# EAGLE design irdroid-htpc (EAGLE 6.5.0)
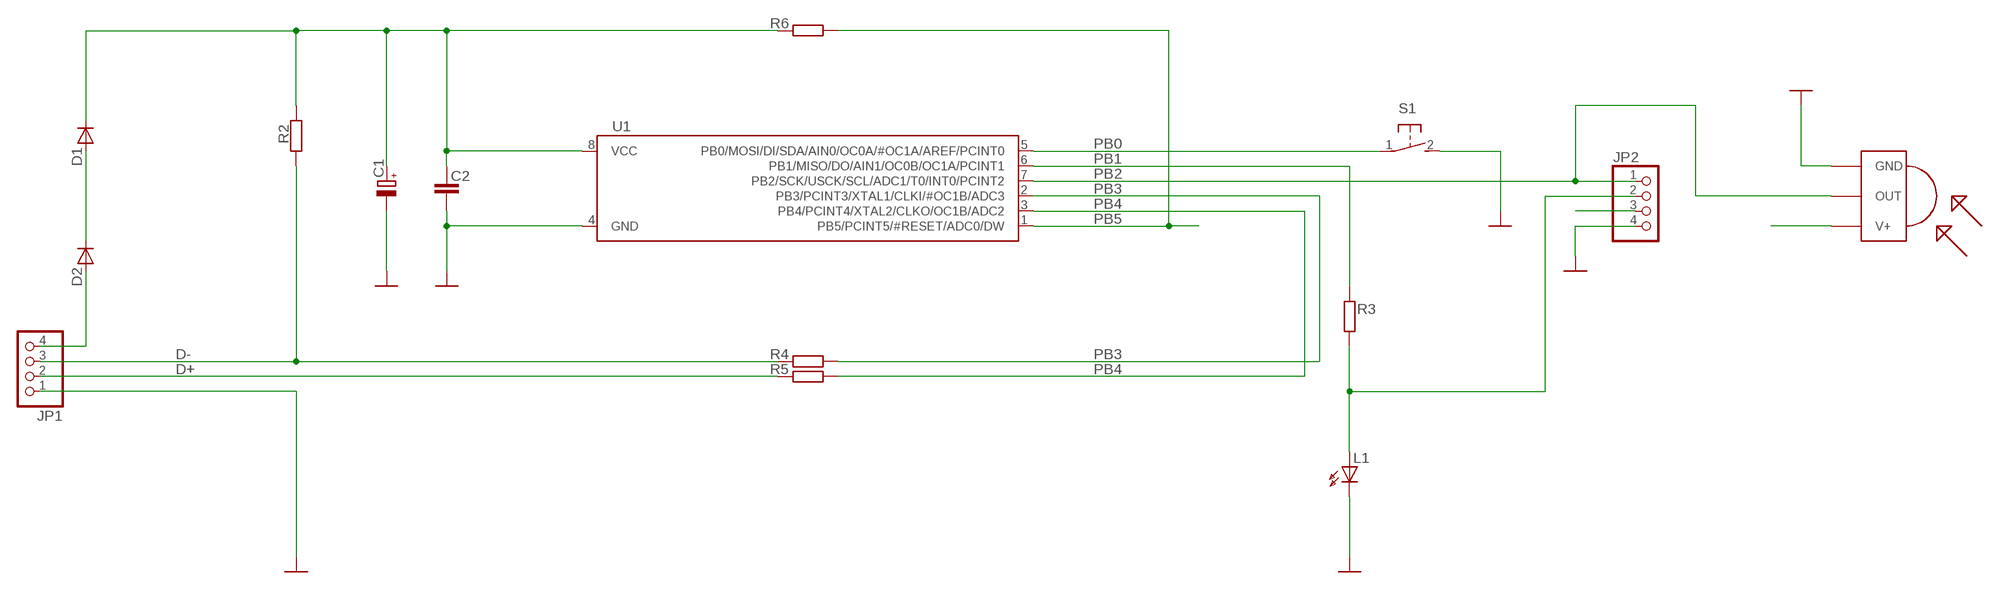
[diagram p0: schematic, sheet 1]

## Parts
C1  CPOL-EUE2-5  [E2-5]
C2  C-EU025-025X050  [C025-025X050]
D1  DDO35  [DO35-200MILS]
D2  DDO35  [DO35-200MILS]
JP1  PINHD-1X4  [1X04]
JP2  PINHD-1X4  [1X04]
L1  LED3.0MM  [LED-3.0MM]
R2  R-EU_0204/5  [0204/5]
R3  R-EU_0204/5  [0204/5]
R4  R-EU_0204/5  [0204/5]
R5  R-EU_0204/5  [0204/5]
R6  R-EU_0204/5  [0204/5]
S1  31-XX  [B3F-31XX]
U1  ATTINY85-20PU  [DIP8]
U$1  TSOP1838  [TSOP18XX]

## Nets
D+: JP1.2 R5.1
D-: JP1.3 R2.1 R4.1
GND [PWR]: C1.- C2.2 JP1.1 JP2.4 L1.K(C) S1.2(S) U1.4(GND) U$1.GND
N$2 [PWR]: D1.A D2.K
N$4: JP2.2 L1.A R3.1
PB0: S1.1(P) U1.5(PB0/MOSI/DI/SDA/AIN0/OC0A/#OC1A/AREF/PCINT0)
PB1: R3.2 U1.6(PB1/MISO/DO/AIN1/OC0B/OC1A/PCINT1)
PB2: JP2.1 U1.7(PB2/SCK/USCK/SCL/ADC1/T0/INT0/PCINT2) U$1.OUT
PB3: R4.2 U1.2(PB3/PCINT3/XTAL1/CLKI/#OC1B/ADC3)
PB4: R5.2 U1.3(PB4/PCINT4/XTAL2/CLKO/OC1B/ADC2)
PB5: R6.2 U1.1(PB5/PCINT5/#RESET/ADC0/DW)
VBUS [PWR]: D2.A JP1.4
VCC [PWR]: C1.+ C2.1 D1.K JP2.3 R2.2 R6.1 U1.8(VCC) U$1.VCC(V+)

## Library data of the parts
C1 = rcl:CPOL-EU: POLARIZED CAPACITOR, European symbol
C2 = rcl:C-EU: CAPACITOR, European symbol
D1 D2 = DOUBLE-SIDE:D: DIODES
JP1 JP2 = pinhead:PINHD-1X4: PIN HEADER
L1 = DOUBLE-SIDE:LED
R2-R6 = rcl:R-EU_: RESISTOR, European symbol
S1 = switch-omron:31-XX: OMRON SWITCH; MPN: B3F-3100; OC_FARNELL: 959704; OC_NEWARK: 36M3582
U1 = OLIMEX_IC:ATTINY85: Atmel 8-bit AVR Microcontroller with 2/4/8K Bytes In-System Programmable Flash Features *High Performance, Low Power AVR® 8-Bit Microcontroller * Advanced RISC Architecture - 120 Powerful Instructions ? Most Single Clock Cycle Execution - 32 x 8 General Purpose Working Registers - Fully Static Operation * Non-volatile Program and Data Memories - 2/4/8K Bytes of In-System Programmable Program Memory Flash * Endurance: 10,000 Write/Erase Cycles - 128/256/512 Bytes In-System Programmable EEPROM * Endurance: 100,000 Write/Erase Cycles - 128/256/512 Bytes Internal SRAM -Programming Lock for Self-Programming Flash Program and EEPROM Data Security *Peripheral Features - 8-bit Timer/Counter with Prescaler and Two PWM Channels - 8-bit High Speed Timer/Counter with Separate Prescaler *2 High Frequency PWM Outputs with Separate Output Compare Registers * Programmable Dead Time Generator -USI - Universal Serial Interface with Start Condition Detector - 10-bit ADC * 4 Single Ended Channels * 2 Differential ADC Channel Pairs with Programmable Gain (1x, 20x) * Temperature Measurement - Programmable Watchdog Timer with Separate On-chip Oscillator - On-chip Analog Comparator * Special Microcontroller Features - debugWIRE On-chip Debug System - In-System Programmable via SPI Port -External and Internal Interrupt Sources - Low Power Idle, ADC Noise Reduction, and Power-down Modes - Enhanced Power-on Reset Circuit - Programmable Brown-out Detection Circuit - Internal Calibrated Oscillator * I/O and Packages - Six Programmable I/O Lines - 8-pin PDIP, 8-pin SOIC, 20-pad QFN/MLF, and 8-pin TSSOP (only ATtiny45/V) * Operating Voltage - 1.8 - 5.5V for ATtiny25V/45V/85V - 2.7 - 5.5V for ATtiny25/45/85 * Speed Grade - ATtiny25V/45V/85V: 0 - 4 MHz @ 1.8 - 5.5V, 0 - 10 MHz @ 2.7 - 5.5V - ATtiny25/45/85: 0 - 10 MHz @ 2.7 - 5.5V, 0 - 20 MHz @ 4.5 - 5.5V * Industrial Temperature Range * Low Power Consumption - Active Mode: * 1 MHz, 1.8V: 300 uA - Power-down Mode: * 0.1 uA at 1.8V
U$1 = tsop:TSOP1838: IR Receiver and Demodulator

## Net classes
1 PWR: width 0.25 mm

## Board
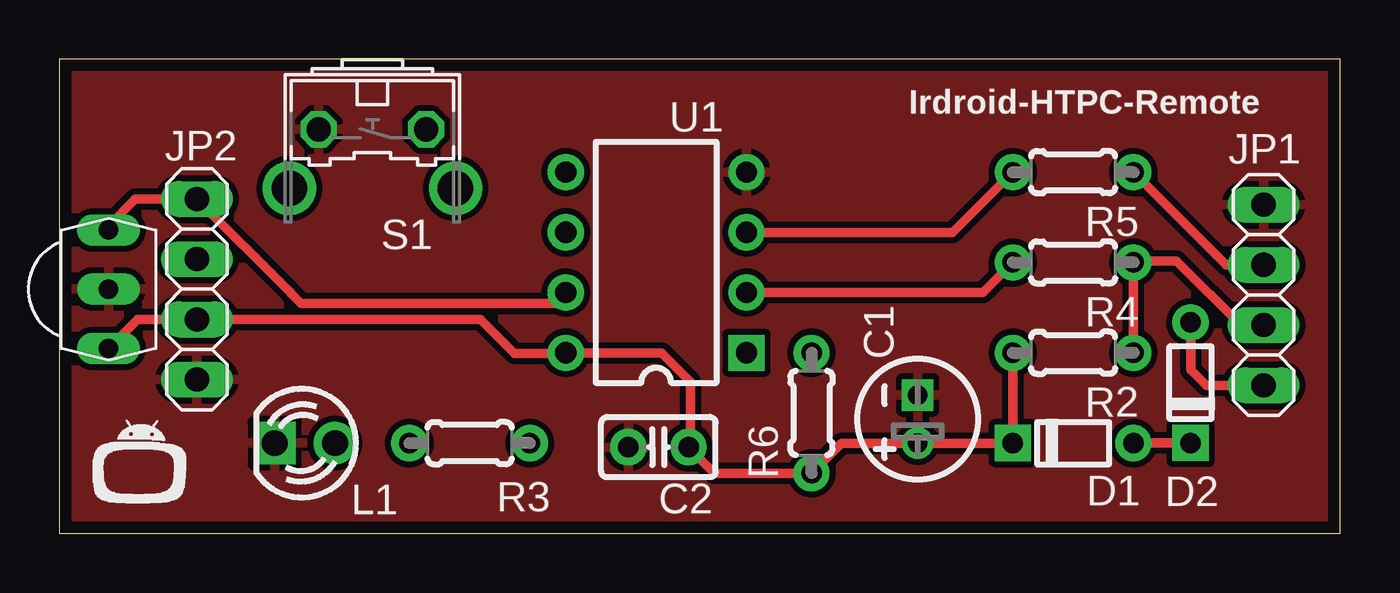
[diagram p1: board, top side]
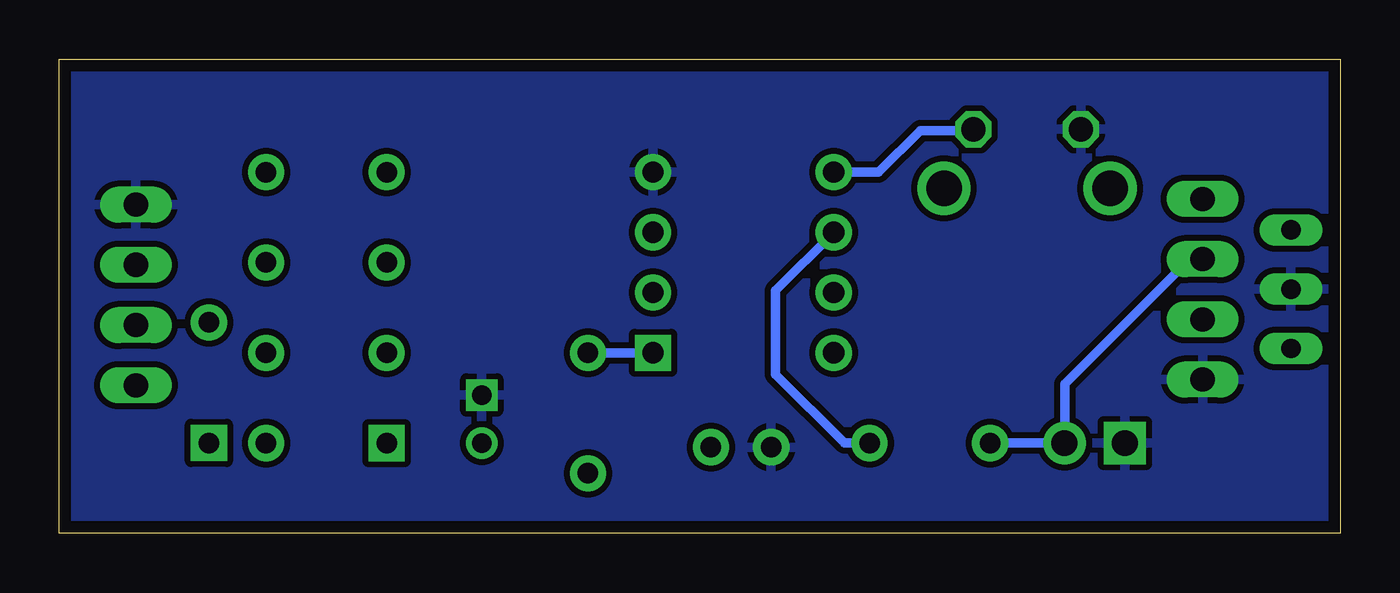
[diagram p2: board, bottom side, seen from below]

Size 54 x 20 mm. Coordinates in mm from the lower left corner, seen from the top.
Outline: 0,0 54,0 54,20 0,20 0,0
Copper layers (1*16): Top 0.035mm / dielectric 1.5mm / Bottom 0.035mm
Design rules "default *": minimum track width 10mil, minimum drill 24mil, track to track 10mil, track to pad 10mil, pad to pad 10mil, via to via 10mil, smd to smd 8mil, copper to edge 20mil, drill to drill 8mil, minimum pad ring 10mil, minimum via ring 8mil, stop-mask expansion 4mil, vias tented up to drill 0mil, thermal gap 10mil

### Footprints (pad centres in the part's own frame; a part is rotated, then mirrored left to right if it is on the bottom)
E2-5 = drill 0.813 pad 1.27: + -1.016,0 | drill 0.813 pad 1.27 square: - 1.016,0
C025-025X050 = drill 0.864 pad 1.524: 1 -1.27,0; 2 1.27,0
DO35-200MILS = drill 0.864 pad 1.524: A 2.54,0 | drill 0.864 pad 1.524 square: K -2.54,0
1X04 = drill 1.016 long: 1 -3.81,0; 2 -1.27,0; 3 1.27,0; 4 3.81,0
LED-3.0MM = drill 1.092 pad 1.778: A -1.27,0 | drill 1.092 pad 1.778 square: K 1.27,0
0204/5 = drill 0.864 pad 1.524: 1 -2.54,0; 2 2.54,0
B3F-31XX = drill 1.016 octagon: 1 -2.261,-1.245; 2 2.261,-1.245 | drill 1.499 pad 2.159: 3 -3.505,1.245; 4 3.505,1.245
DIP8 = drill 0.9 pad 1.524 square: 1 -3.81,-3.81 | drill 0.9 pad 1.524: 2 -1.27,-3.81; 3 1.27,-3.81; 4 3.81,-3.81; 5 3.81,3.81; 6 1.27,3.81; 7 -1.27,3.81; 8 -3.81,3.81
TSOP18XX = drill 0.813 long: GND -0.001,-0.027; OUT -2.501,-0.027; VCC 2.499,-0.027

### Placement (x,y rotation side)
C1  36.19,4.82 90 top
C2  25.26,3.64 180 top
D1  42.74,3.81 0 top
D2  47.69,6.36 90 top
JP1  50.77,10.06 270 top
JP2  5.8,10.3 270 top
L1  10.35,3.81 180 top
R2  42.74,7.62 180 top
R3  17.3,3.81 0 top
R4  42.74,11.43 180 top
R5  42.74,15.24 180 top
R6  31.71,5.08 90 top
S1  13.2,15.8 180 top
U1  25.16,11.43 90 top
U$1  2.1,10.3 270 top
U$2  [IRDROIDLOGO]  1.1,1 0 top

### Tracks (layer width: path | path; a pad name or v marks a point on that pad's centre or on a via)
D+
  Top 0.406: JP1.2 49.19,11.33 R5.1
D-
  Top 0.406: R2.1 R4.1 45.35,11.5 47.1,11.5 49.81,8.79 JP1.3
GND
  pour Top: 0,20 54,20 54,0 0,0
  pour Bottom: 0,20 54,20 54,0 0,0
N$2
  Top 0.406: D1.A D2.K
N$4
  Bottom 0.406: JP2.2 6.33,11.57 11.6,6.3 11.6,3.83 L1.A R3.1
PB0
  Bottom 0.406: U1.5 19.46,15.24 17.7,17 15.51,17 S1.1
PB1
  Bottom 0.406: R3.2 20.91,3.81 23.8,6.7 23.8,10.25 U1.6
PB2
  Top 0.406: U$1.OUT 2.07,12.97 3.2,14.1 JP2.1 9.75,10.16 9.75,10.15 10.2,9.7 20.89,9.7 U1.7
PB3
  Top 0.406: U1.2 38.93,10.16 R4.2
PB4
  Top 0.406: U1.3 37.66,12.7 R5.2
PB5
  Bottom 0.406: U1.1 R6.2
VBUS
  Top 0.406: JP1.4 48.35,6.25 47.7,6.9 D2.A
VCC
  Top 0.406: R2.2 D1.K C1.+ 32.97,3.8 R6.1 27.63,2.54 C2.1 26.6,3.71 26.6,6.4 25.38,7.62 U1.8 21.33,7.6 19.2,7.6 17.77,9.03 JP2.3 3.3,9.03 U$1.VCC

### Text on the board
tNames: Irdroid-HTPC-Remote